# EAGLE design EnviEye (EAGLE 9.6.2)
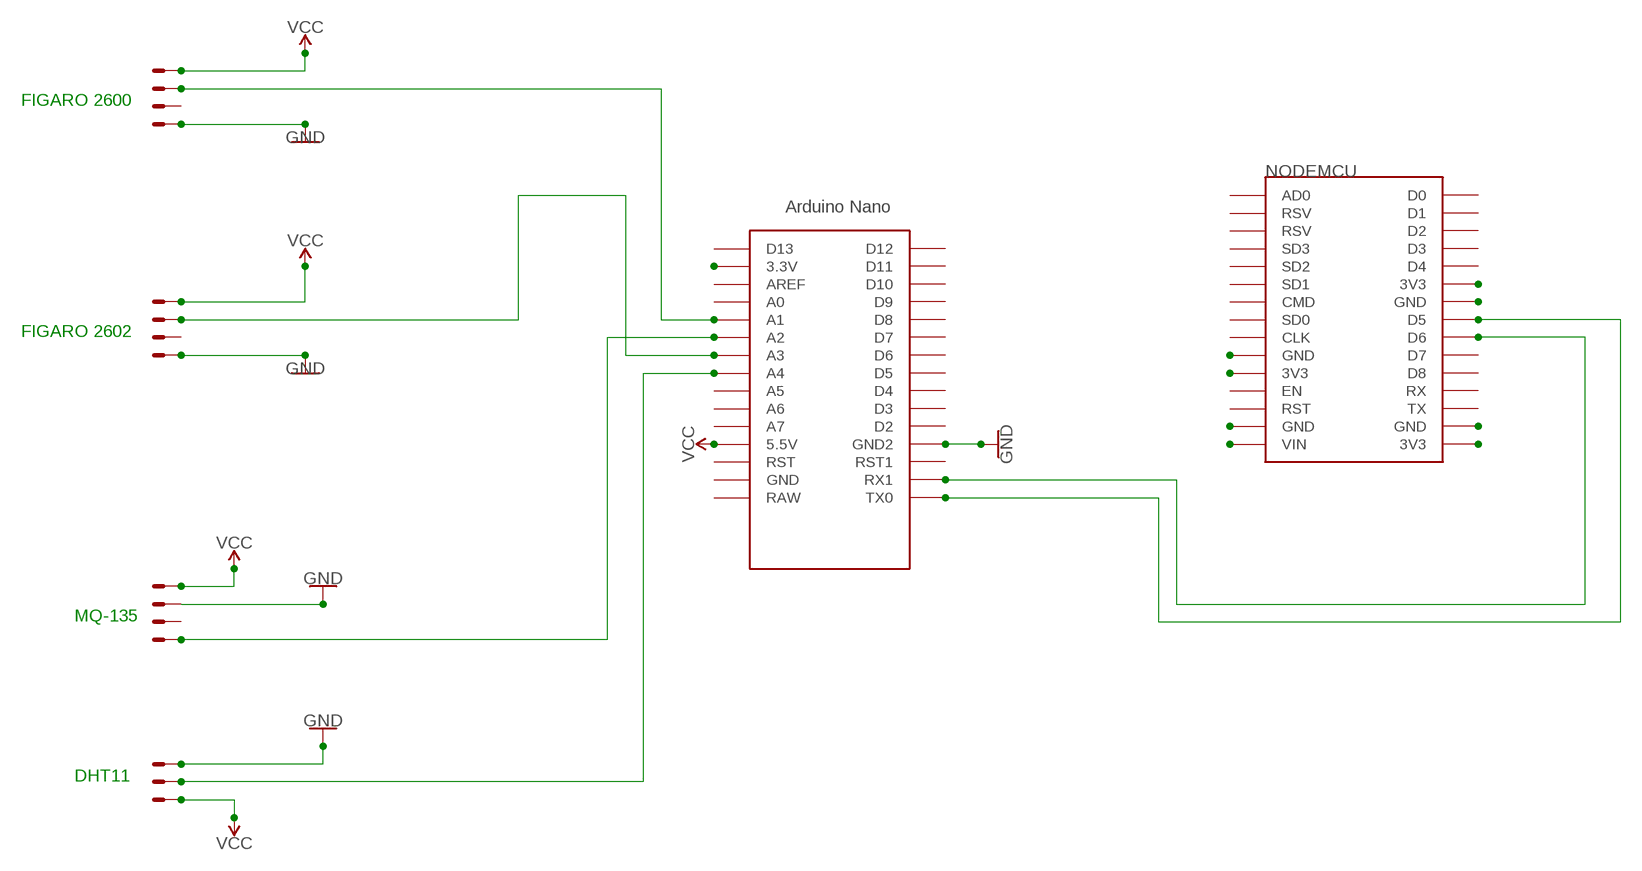
[diagram p0: schematic, sheet 1]

## Parts
DHT11  22-23-2031  [22-23-2031]
FIGARO2600  22-23-2041  [22-23-2041]
FIGARO2602  22-23-2041  [22-23-2041]
MQ-135  22-23-2041  [22-23-2041]
NODEMCU  ESP12E_DEVKIT  [ESP12E_DEVKIT]
U$1  NANO  [NANO]

## Nets
GND: DHT11.3 FIGARO2600.4 FIGARO2602.4 MQ-135.2 U$1.GND1(GND2)
N$1: NODEMCU.GND@1(GND)
N$3: NODEMCU.VIN
N$4: FIGARO2600.2 U$1.A3
N$6: FIGARO2602.2 U$1.A1
N$8: NODEMCU.D6 U$1.RX1
N$9: NODEMCU.D5 U$1.TX0
N$11: NODEMCU.GND@0(GND)
N$21: U$1.3.3V
N$22: NODEMCU.3V3@0(3V3)
N$23: DHT11.2 U$1.A4
N$24: MQ-135.4 U$1.A2
N$25: NODEMCU.GND@3(GND)
N$26: NODEMCU.3V3@2(3V3)
N$27: NODEMCU.3V3@1(3V3)
N$28: NODEMCU.GND@2(GND)
VCC: DHT11.1 FIGARO2600.1 FIGARO2602.1 MQ-135.1 U$1.5V(5.5V)
Unconnected: FIGARO2600.3 FIGARO2602.3 MQ-135.3 NODEMCU.AD0 NODEMCU.CLK NODEMCU.CMD NODEMCU.D0 NODEMCU.D1 NODEMCU.D2 NODEMCU.D3 NODEMCU.D4 NODEMCU.D7 NODEMCU.D8 NODEMCU.EN NODEMCU.RST NODEMCU.RSV@0(RSV) NODEMCU.RSV@1(RSV) NODEMCU.RX NODEMCU.SD0 NODEMCU.SD1 NODEMCU.SD2 NODEMCU.SD3 NODEMCU.TX U$1.A0 U$1.A5 U$1.A6 U$1.A7 U$1.AREF U$1.D2 U$1.D3 U$1.D4 U$1.D5 U$1.D6 U$1.D7 U$1.D8 U$1.D9 U$1.D10 U$1.D11 U$1.D12 U$1.D13 U$1.GND U$1.ICSP1 U$1.ICSP2 U$1.ICSP3 U$1.ICSP4 U$1.ICSP5 U$1.ICSP6 U$1.RAW U$1.RST U$1.RST1

## Notes on the sheet
- FIGARO 2600
- FIGARO 2602
- MQ-135
- DHT11

## Library data of the parts
DHT11 = con-molex:22-23-2031: .100" (2.54mm) Center Header - 3 Pin; MF: MOLEX; MPN: 22-23-2031; OC_FARNELL: 1462950; OC_NEWARK: 30C0862
FIGARO2600 FIGARO2602 MQ-135 = con-molex:22-23-2041: .100" (2.54mm) Center Header - 4 Pin; MF: MOLEX; MPN: 22-23-2041; OC_FARNELL: 1462920; OC_NEWARK: 38C0355
NODEMCU = ESP12E_DEVKIT:ESP12E_DEVKIT: ESP12E DEVKIT BOARD
U$1 = Arduino-clone:NANO: Arduino Nano

## Net classes
0 default: width 0.457 mm, clearance 0.432 mm
1 supply: width 0.584 mm, clearance 0.508 mm

## Board
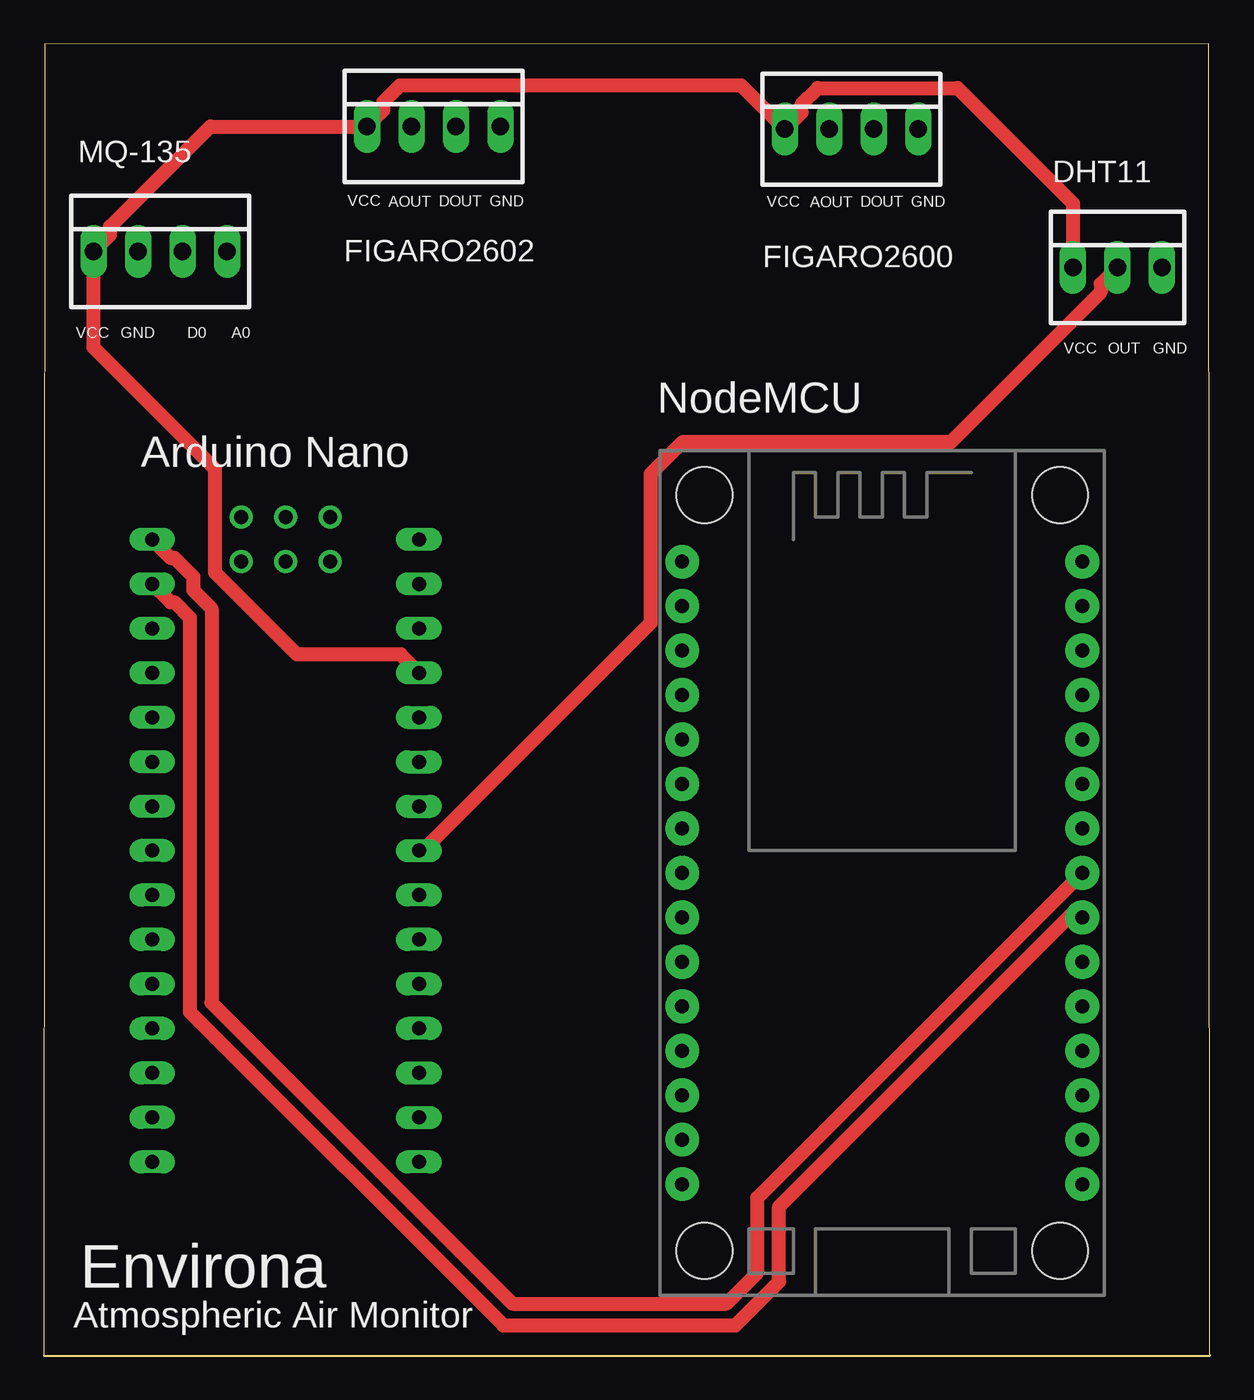
[diagram p1: board, top side]
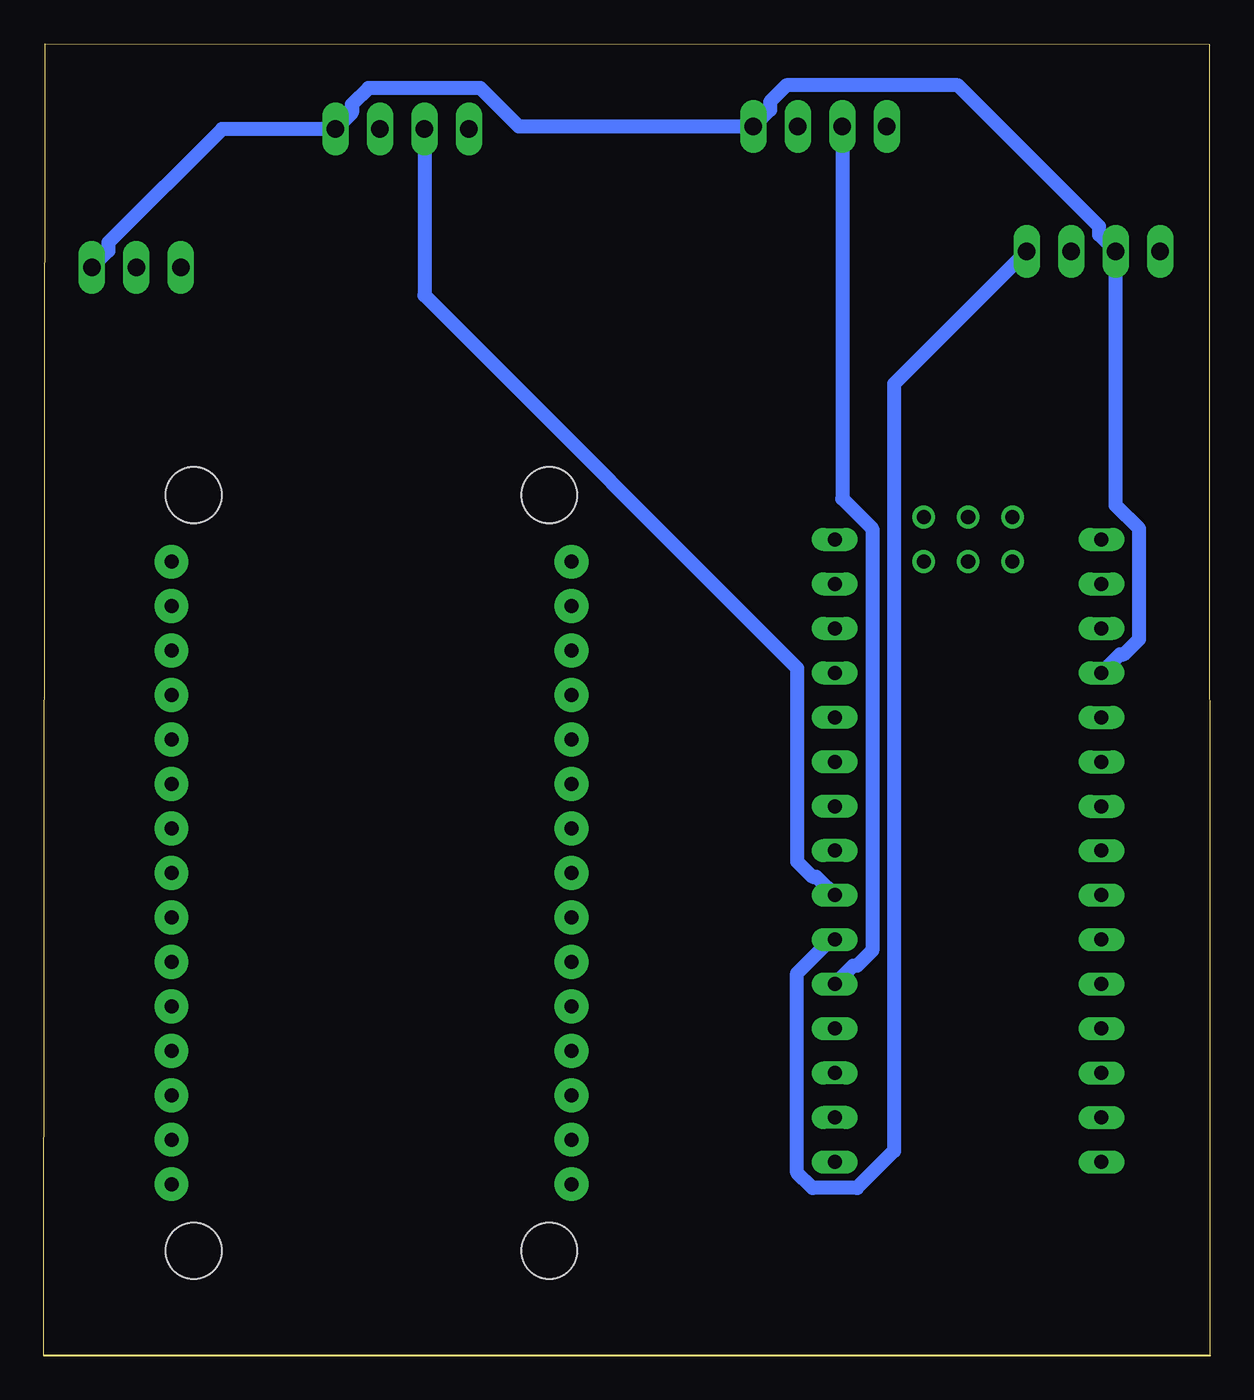
[diagram p2: board, bottom side, seen from below]

Size 66.63 x 74.96 mm. Coordinates in mm from the lower left corner, seen from the top.
Outline: 0,0 66.63,0 66.55,74.96 0.05,74.93 0,0
Copper layers (1*16): Top 0.035mm / dielectric 1.5mm / Bottom 0.035mm
Design rules "default": minimum track width 6mil, minimum drill 0.35mm, track to track 6mil, track to pad 6mil, pad to pad 6mil, via to via 6mil, smd to smd 6mil, copper to edge 40mil, drill to drill 6mil, minimum pad ring 10mil, minimum via ring 8mil, stop-mask expansion 4mil, vias tented up to drill 0mil, thermal gap 10mil

### Footprints (pad centres in the part's own frame; a part is rotated, then mirrored left to right if it is on the bottom)
22-23-2031 = drill 1 long: 1 -2.54,0; 2 0,0; 3 2.54,0
22-23-2041 = drill 1 long: 1 -3.81,0; 2 -1.27,0; 3 1.27,0; 4 3.81,0
ESP12E_DEVKIT = drill 0.8 pad 1.93: 3V3@0 -11.43,-7.62; 3V3@1 11.43,5.08; 3V3@2 11.43,-17.78; AD0 -11.43,17.78; CLK -11.43,-2.54; CMD -11.43,2.54; D0 11.43,17.78; D1 11.43,15.24; D2 11.43,12.7; D3 11.43,10.16; D4 11.43,7.62; D5 11.43,0; D6 11.43,-2.54; D7 11.43,-5.08; D8 11.43,-7.62; EN -11.43,-10.16; GND@0 -11.43,-5.08; GND@1 -11.43,-15.24; GND@2 11.43,2.54; GND@3 11.43,-15.24; RST -11.43,-12.7; RSV@0 -11.43,15.24; RSV@1 -11.43,12.7; RX 11.43,-10.16; SD0 -11.43,0; SD1 -11.43,5.08; SD2 -11.43,7.62; SD3 -11.43,10.16; TX 11.43,-12.7; VIN -11.43,-17.78 | hole 3.2: -10.16,21.59; 10.16,21.59; 10.16,-21.59; -10.16,-21.59
NANO = drill 0.8 long: 3.3V -10.16,24.13; 5V -10.16,-1.27; A0 -10.16,19.05; A1 -10.16,16.51; A2 -10.16,13.97; A3 -10.16,11.43; A4 -10.16,8.89; A5 -10.16,6.35; A6 -10.16,3.81; A7 -10.16,1.27; AREF -10.16,21.59; D2 5.08,1.27; D3 5.08,3.81; D4 5.08,6.35; D5 5.08,8.89; D6 5.08,11.43; D7 5.08,13.97; D8 5.08,16.51; D9 5.08,19.05; D10 5.08,21.59; D11 5.08,24.13; D12 5.08,26.67; D13 -10.16,26.67; GND -10.16,-6.35; GND1 5.08,-1.27; RAW -10.16,-8.89; RST -10.16,-3.81; RST1 5.08,-3.81; RX1 5.08,-6.35; TX0 5.08,-8.89 | drill 0.8: ICSP1 -5.08,-10.16; ICSP2 -5.08,-7.62; ICSP3 -2.54,-10.16; ICSP4 -2.54,-7.62; ICSP5 0,-10.16; ICSP6 0,-7.62

### Placement (x,y rotation side)
DHT11  61.34,62.18 0 top
FIGARO2600  46.15,70.08 0 top
FIGARO2602  22.28,70.23 0 top
MQ-135  6.65,63.09 0 top
NODEMCU  47.9,27.58 0 top
U$1  11.28,37.74 180 top

### Tracks (layer width: path | path; a pad name or v marks a point on that pad's centre or on a via)
GND
  Bottom 0.813: U$1.GND1 5.15,40.06 4.93,40.06 4.05,40.94 4.05,47.25 5.39,48.59 MQ-135.2 6.33,64.04 6.33,64.51 14.4,72.58 24.2,72.58 25.14,71.64 25.14,71.18 FIGARO2602.4 39.49,70.23 41.68,72.42 48.08,72.42 49.01,71.49 49.01,71.03 FIGARO2600.4 56.45,70.08 62.93,63.59 62.93,63.13 DHT11.3
N$4
  Bottom 0.813: U$1.A3 22.48,27.36 22.71,27.36 23.58,28.24 23.58,39.29 44.88,60.59 FIGARO2600.2
N$6
  Bottom 0.813: FIGARO2602.2 21.01,48.97 19.29,47.25 19.29,23.16 20.17,22.28 20.39,22.28 U$1.A1
N$8
  Top 0.813: U$1.RX1 7.25,43.05 7.47,43.05 8.34,42.17 8.34,19.64 26.26,1.73 39.51,1.73 42.01,4.23 42.01,8.51 58.77,25.27 59.1,25.27 NODEMCU.D6
N$9
  Top 0.813: U$1.TX0 7.25,45.59 7.47,45.59 8.54,44.52 8.54,43.74 9.59,42.69 9.59,20.16 26.78,2.97 39,2.97 40.77,4.74 40.77,9.03 NODEMCU.D5
N$23
  Top 0.813: DHT11.2 60.39,61.23 60.39,60.77 51.82,52.2 36.49,52.2 34.67,50.38 34.67,41.86 21.66,28.85 U$1.A4
N$24
  Bottom 0.813: MQ-135.4 18.05,55.51 18.05,11.7 20.17,9.58 22.71,9.58 23.58,10.46 23.58,21.85 21.66,23.77 U$1.A2
VCC
  Top 0.813: U$1.5V 20.39,40.06 14.47,40.06 9.79,44.75 9.79,50.67 2.84,57.61 MQ-135.1 3.79,64.04 3.79,64.51 9.52,70.23 FIGARO2602.1 19.41,71.18 19.41,71.64 20.35,72.58 39.84,72.58 FIGARO2600.1 43.29,71.03 43.29,71.49 44.22,72.42 52.21,72.42 58.8,65.84 DHT11.1

### Text on the board
tNames: DHT11 | VCC | AOUT | DOUT | GND | VCC | AOUT | DOUT | GND | VCC | GND | D0 | A0 | VCC | OUT | GND | NodeMCU | Arduino Nano | Environa | Atmospheric Air Monitor